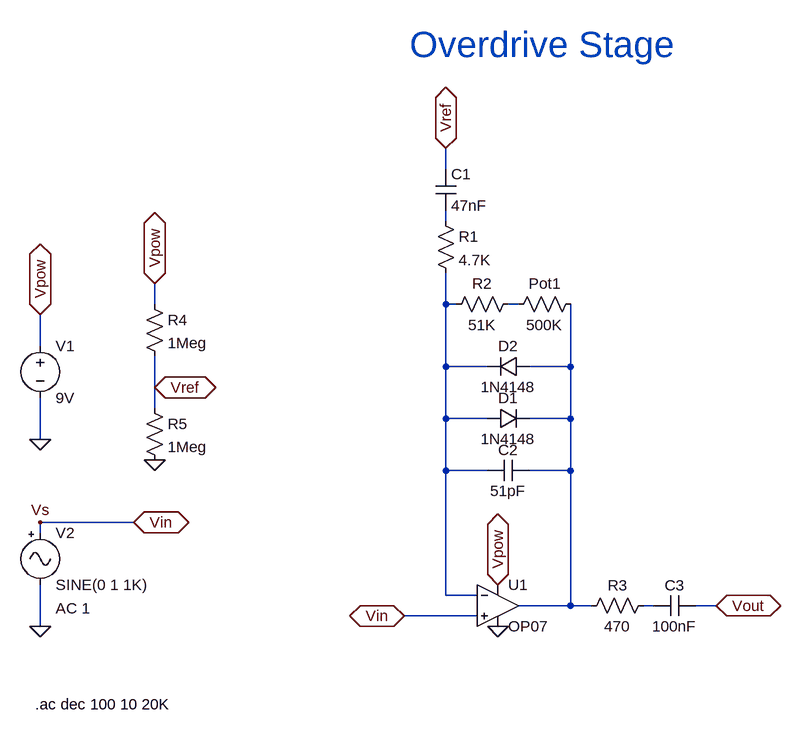
[diagram p0: schematic Overdrive.asc]
Overdrive.asc, the LTspice schematic file:
Version 4
SHEET 1 880 1104
WIRE -80 32 -80 0
WIRE -80 112 -80 96
WIRE -528 240 -528 208
WIRE -80 240 -80 192
WIRE -64 240 -80 240
WIRE 32 240 16 240
WIRE -704 304 -704 256
WIRE -80 336 -80 240
WIRE -16 336 -80 336
WIRE 112 336 112 240
WIRE 112 336 48 336
WIRE -528 368 -528 320
WIRE -528 400 -528 368
WIRE -80 416 -80 336
WIRE -16 416 -80 416
WIRE 112 416 112 336
WIRE 112 416 48 416
WIRE -704 448 -704 384
WIRE -80 496 -80 416
WIRE -16 496 -80 496
WIRE 112 496 112 416
WIRE 112 496 48 496
WIRE -560 576 -704 576
WIRE -704 592 -704 576
WIRE -80 688 -80 496
WIRE -32 688 -80 688
WIRE 112 704 112 496
WIRE 112 704 32 704
WIRE 144 704 112 704
WIRE 240 704 224 704
WIRE 336 704 304 704
WIRE -32 720 -144 720
WIRE -704 736 -704 672
FLAG 0 672 Vpow
IOPIN 0 672 BiDir
FLAG 0 736 0
FLAG -80 0 Vref
IOPIN -80 0 BiDir
FLAG 336 704 Vout
IOPIN 336 704 BiDir
FLAG -144 720 Vin
IOPIN -144 720 BiDir
FLAG -704 448 0
FLAG -704 256 Vpow
IOPIN -704 256 BiDir
FLAG -528 480 0
FLAG -528 208 Vpow
IOPIN -528 208 BiDir
FLAG -528 368 Vref
IOPIN -528 368 BiDir
FLAG -704 736 0
FLAG -704 576 Vs
FLAG -560 576 Vin
IOPIN -560 576 BiDir
SYMBOL OpAmps\\OP07 0 640 R0
SYMATTR InstName U1
SYMBOL res 128 224 R90
WINDOW 0 0 56 VBottom 2
WINDOW 3 32 56 VTop 2
SYMATTR InstName Pot1
SYMATTR Value 500K
SYMBOL res -96 96 R0
SYMATTR InstName R1
SYMATTR Value 4.7K
SYMBOL diode -16 432 R270
WINDOW 0 32 32 VTop 2
WINDOW 3 0 32 VBottom 2
SYMATTR InstName D1
SYMATTR Value 1N4148
SYMBOL diode 48 320 R90
WINDOW 0 0 32 VBottom 2
WINDOW 3 32 32 VTop 2
SYMATTR InstName D2
SYMATTR Value 1N4148
SYMBOL cap -96 32 R0
SYMATTR InstName C1
SYMATTR Value 47nF
SYMBOL cap 48 480 R90
WINDOW 0 0 32 VBottom 2
WINDOW 3 32 32 VTop 2
SYMATTR InstName C2
SYMATTR Value 51pF
SYMBOL res 32 224 R90
WINDOW 0 0 56 VBottom 2
WINDOW 3 32 56 VTop 2
SYMATTR InstName R2
SYMATTR Value 51K
SYMBOL cap 304 688 R90
WINDOW 0 0 32 VBottom 2
WINDOW 3 32 32 VTop 2
SYMATTR InstName C3
SYMATTR Value 100nF
SYMBOL res 240 688 R90
WINDOW 0 0 56 VBottom 2
WINDOW 3 32 56 VTop 2
SYMATTR InstName R3
SYMATTR Value 470
SYMBOL voltage -704 288 R0
WINDOW 123 0 0 Left 0
WINDOW 39 0 0 Left 0
SYMATTR InstName V1
SYMATTR Value 9V
SYMBOL res -544 224 R0
SYMATTR InstName R4
SYMATTR Value 1Meg
SYMBOL res -544 384 R0
SYMATTR InstName R5
SYMATTR Value 1Meg
SYMBOL Misc\\signal -704 576 R0
WINDOW 123 24 132 Left 2
WINDOW 39 0 0 Left 0
SYMATTR Value2 AC 1
SYMATTR InstName V2
TEXT -136 -160 Left 5 ;Overdrive Stage
TEXT -712 856 Left 2 !.ac dec 100 10 20K

The netlist it stands for:
* Overdrive.asc
XU1 Vs N002 Vpow 0 N004 LT1001  ; OP07, pins In+ In- V+ V- OUT
R§Pot1 N004 N003 500K
R1 N001 N002 4.7K
D1 N002 N004 1N4148
D2 N004 N002 1N4148
C1 Vref N001 47nF
C2 N004 N002 51pF
R2 N003 N002 51K
C3 Vout N005 100nF
R3 N005 N004 470
V1 Vpow 0 9V
R4 Vpow Vref 1Meg
R5 Vref 0 1Meg
V2 Vs 0 SINE(0 1 1K) AC 1
.model D D
.lib standard.dio
* Overdrive Stage
.ac dec 100 10 20K
.lib LTC.lib
.backanno
.end